# EasyEDA schematic BIT 3.json
TITLE: TRICORE | ALU | CMP; REV: 1.0; Date: 2022-01-05; Sheet: 5/8; Drawn By: Koehler, Paul; Company: komed3
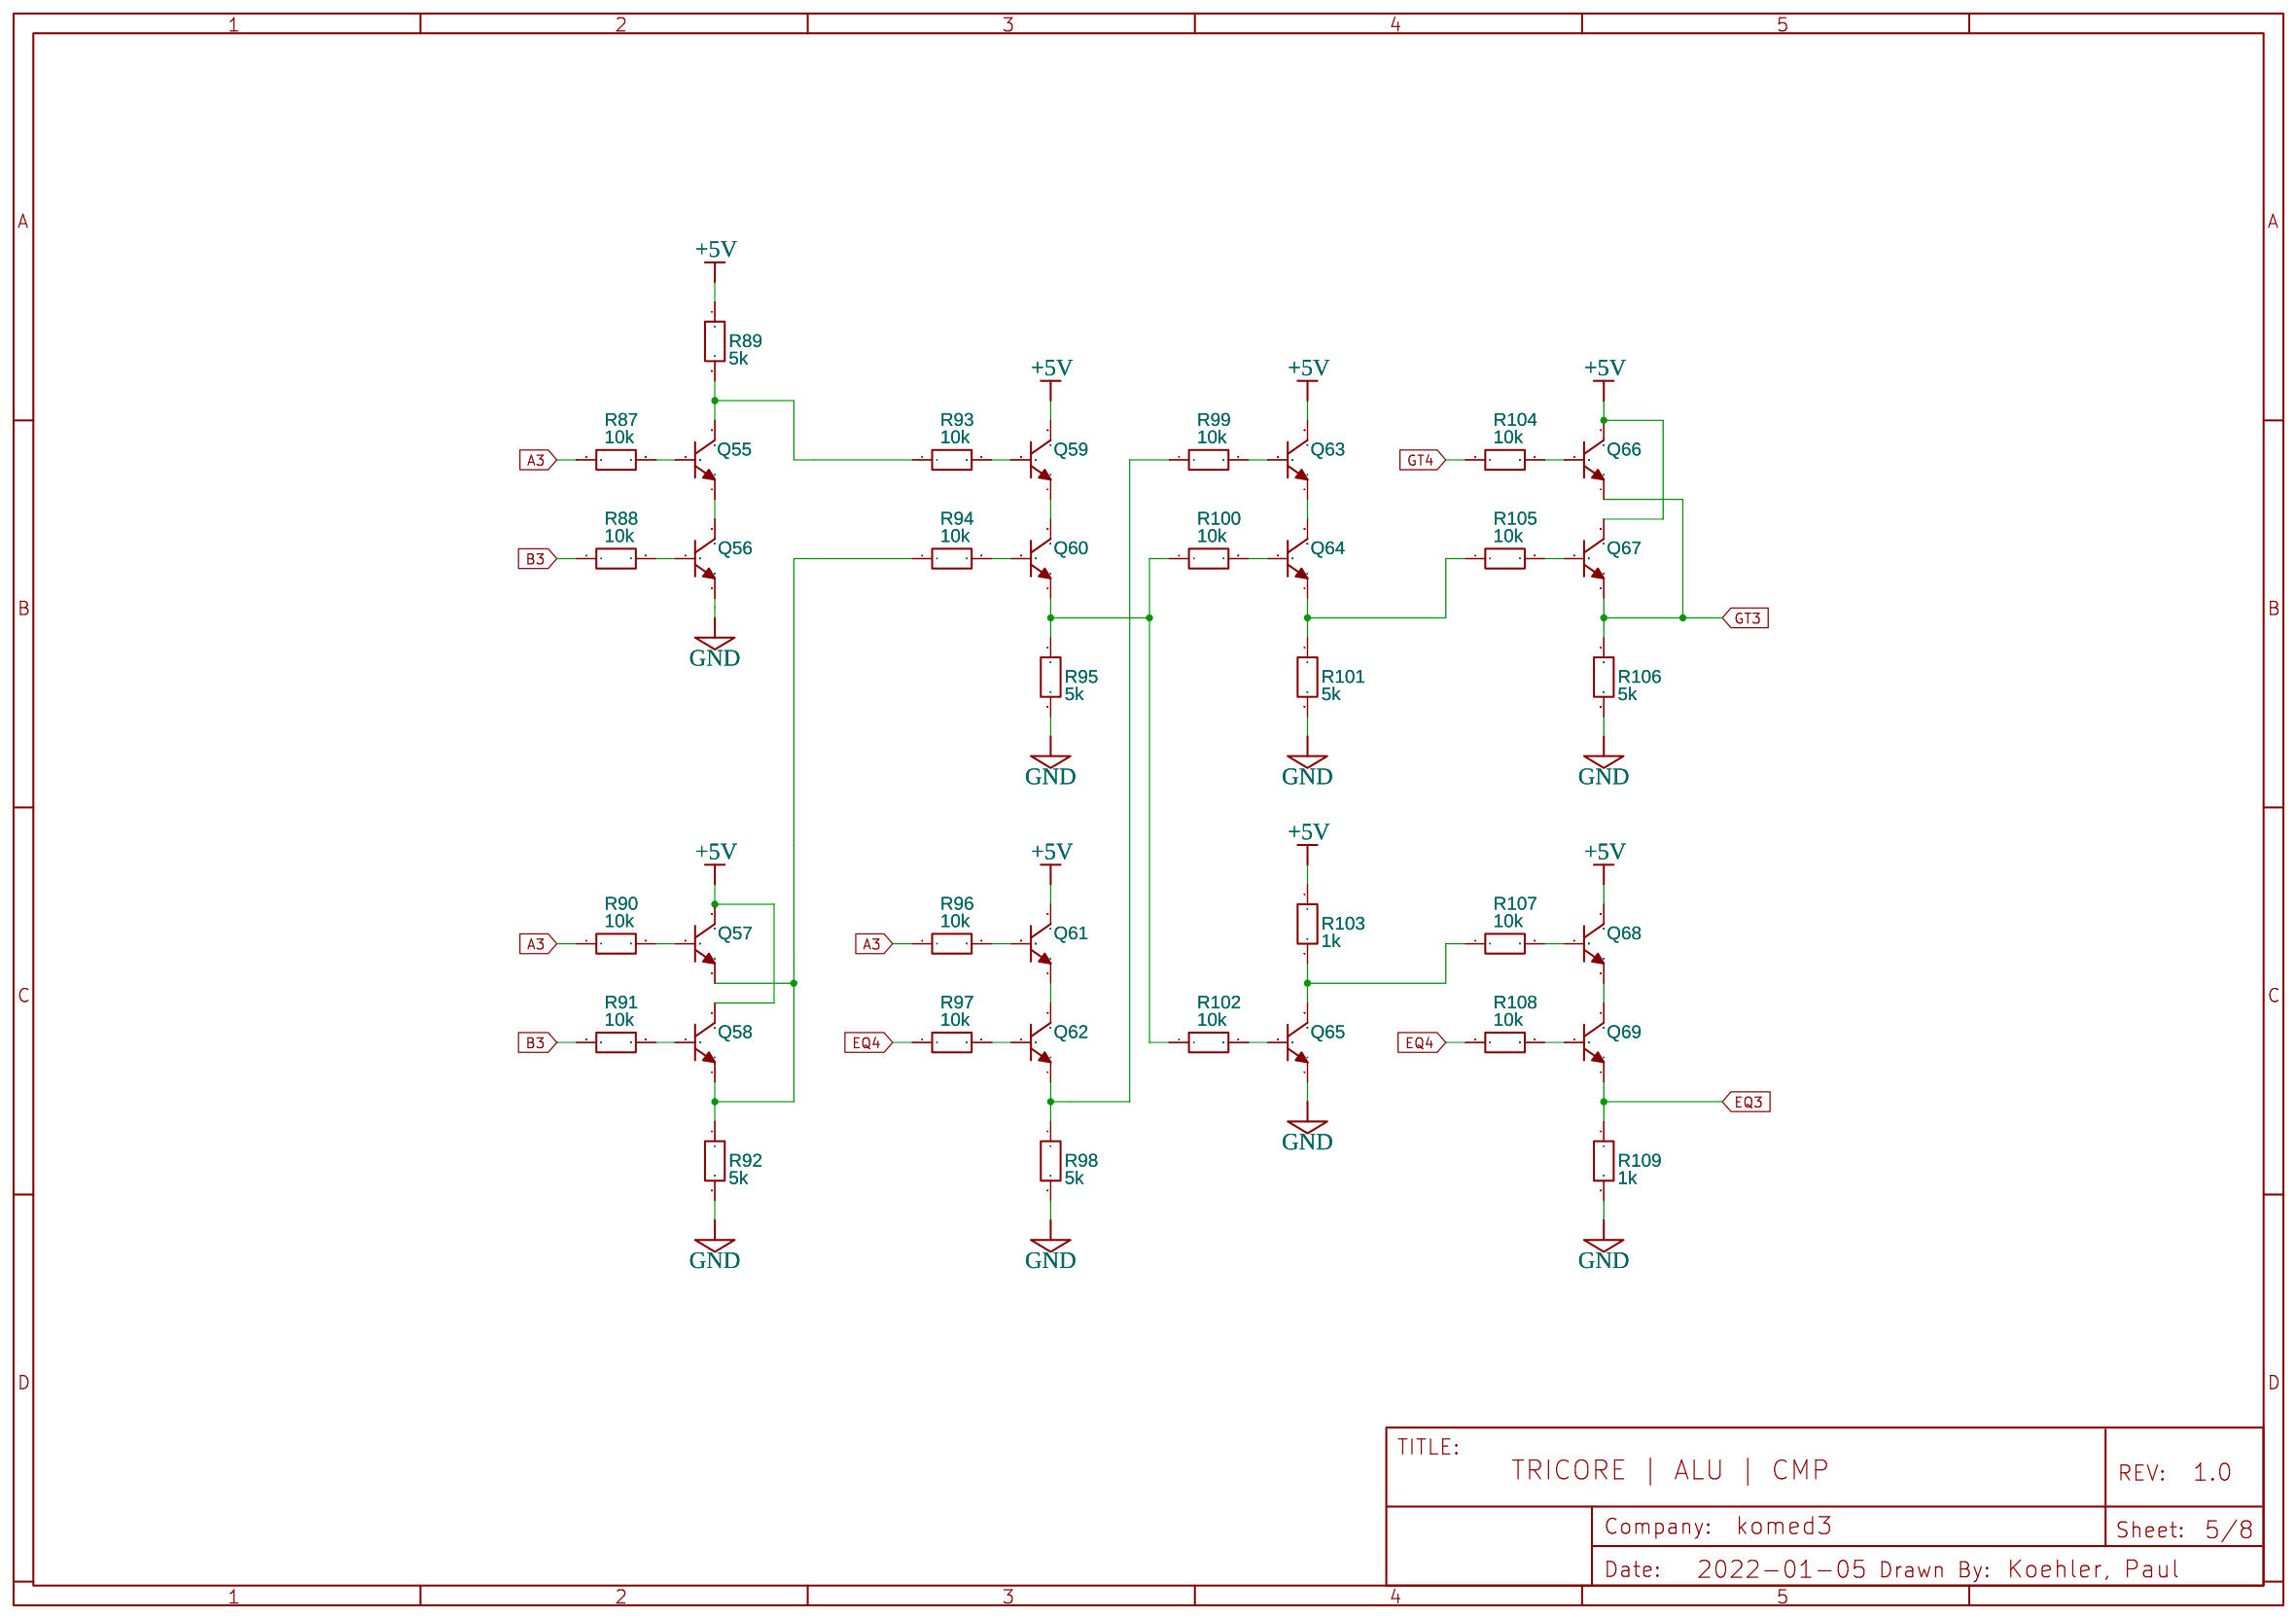
[diagram p0: schematic sheet]

## Parts
Q55  2N3904(TO-92)  [TO-92-3_L5.1-W4.1-P1.27-L]
Q56  2N3904(TO-92)  [TO-92-3_L5.1-W4.1-P1.27-L]
Q57  2N3904(TO-92)  [TO-92-3_L5.1-W4.1-P1.27-L]
Q58  2N3904(TO-92)  [TO-92-3_L5.1-W4.1-P1.27-L]
Q59  2N3904(TO-92)  [TO-92-3_L5.1-W4.1-P1.27-L]
Q60  2N3904(TO-92)  [TO-92-3_L5.1-W4.1-P1.27-L]
Q61  2N3904(TO-92)  [TO-92-3_L5.1-W4.1-P1.27-L]
Q62  2N3904(TO-92)  [TO-92-3_L5.1-W4.1-P1.27-L]
Q63  2N3904(TO-92)  [TO-92-3_L5.1-W4.1-P1.27-L]
Q64  2N3904(TO-92)  [TO-92-3_L5.1-W4.1-P1.27-L]
Q65  2N3904(TO-92)  [TO-92-3_L5.1-W4.1-P1.27-L]
Q66  2N3904(TO-92)  [TO-92-3_L5.1-W4.1-P1.27-L]
Q67  2N3904(TO-92)  [TO-92-3_L5.1-W4.1-P1.27-L]
Q68  2N3904(TO-92)  [TO-92-3_L5.1-W4.1-P1.27-L]
Q69  2N3904(TO-92)  [TO-92-3_L5.1-W4.1-P1.27-L]
R87  10k  [R_AXIAL-0.3]
R88  10k  [R_AXIAL-0.3]
R89  5k  [R_AXIAL-0.3]
R90  10k  [R_AXIAL-0.3]
R91  10k  [R_AXIAL-0.3]
R92  5k  [R_AXIAL-0.3]
R93  10k  [R_AXIAL-0.3]
R94  10k  [R_AXIAL-0.3]
R95  5k  [R_AXIAL-0.3]
R96  10k  [R_AXIAL-0.3]
R97  10k  [R_AXIAL-0.3]
R98  5k  [R_AXIAL-0.3]
R99  10k  [R_AXIAL-0.3]
R100  10k  [R_AXIAL-0.3]
R101  5k  [R_AXIAL-0.3]
R102  10k  [R_AXIAL-0.3]
R103  1k  [R_AXIAL-0.3]
R104  10k  [R_AXIAL-0.3]
R105  10k  [R_AXIAL-0.3]
R106  5k  [R_AXIAL-0.3]
R107  10k  [R_AXIAL-0.3]
R108  10k  [R_AXIAL-0.3]
R109  1k  [R_AXIAL-0.3]

## Library data of the parts
Q55-Q69 = 2N3904(TO-92): Supplier: LCSC; Manufacturer: SEMTECH; Manufacturer Part: 2N3904; Supplier Part: C118538; Contributor: LCEDA_Lib
R87-R109 = R_AXIAL-0.3_EU: Contributor: LCEDA_Lib

## Nets
+5V: Q57.3(C) Q58.3(C) Q59.3(C) Q61.3(C) Q63.3(C) Q66.3(C) Q67.3(C) Q68.3(C) R89.1 R103.1
GND: Q56.1(E) Q65.1(E) R92.2 R95.2 R98.2 R101.2 R106.2 R109.2
A3: R87.1 R90.1 R96.1
B3: R88.1 R91.1
EQ3: Q69.1(E) R109.1
EQ4: R97.1 R108.1
GT3: Q66.1(E) Q67.1(E) R106.1
GT4: R104.1
Net-(Q55-1): Q55.1(E) Q56.3(C)
Net-(Q55-2): Q55.2(B) R87.2
Net-(Q55-3): Q55.3(C) R89.2 R93.1
Net-(Q56-2): Q56.2(B) R88.2
Net-(Q57-1): Q57.1(E) Q58.1(E) R92.1 R94.1
Net-(Q57-2): Q57.2(B) R90.2
Net-(Q58-2): Q58.2(B) R91.2
Net-(Q59-1): Q59.1(E) Q60.3(C)
Net-(Q59-2): Q59.2(B) R93.2
Net-(Q60-1): Q60.1(E) R95.1 R100.1 R102.1
Net-(Q60-2): Q60.2(B) R94.2
Net-(Q61-1): Q61.1(E) Q62.3(C)
Net-(Q61-2): Q61.2(B) R96.2
Net-(Q62-1): Q62.1(E) R98.1 R99.1
Net-(Q62-2): Q62.2(B) R97.2
Net-(Q63-1): Q63.1(E) Q64.3(C)
Net-(Q63-2): Q63.2(B) R99.2
Net-(Q64-1): Q64.1(E) R101.1 R105.1
Net-(Q64-2): Q64.2(B) R100.2
Net-(Q65-2): Q65.2(B) R102.2
Net-(Q65-3): Q65.3(C) R103.2 R107.1
Net-(Q66-2): Q66.2(B) R104.2
Net-(Q67-2): Q67.2(B) R105.2
Net-(Q68-1): Q68.1(E) Q69.3(C)
Net-(Q68-2): Q68.2(B) R107.2
Net-(Q69-2): Q69.2(B) R108.2
